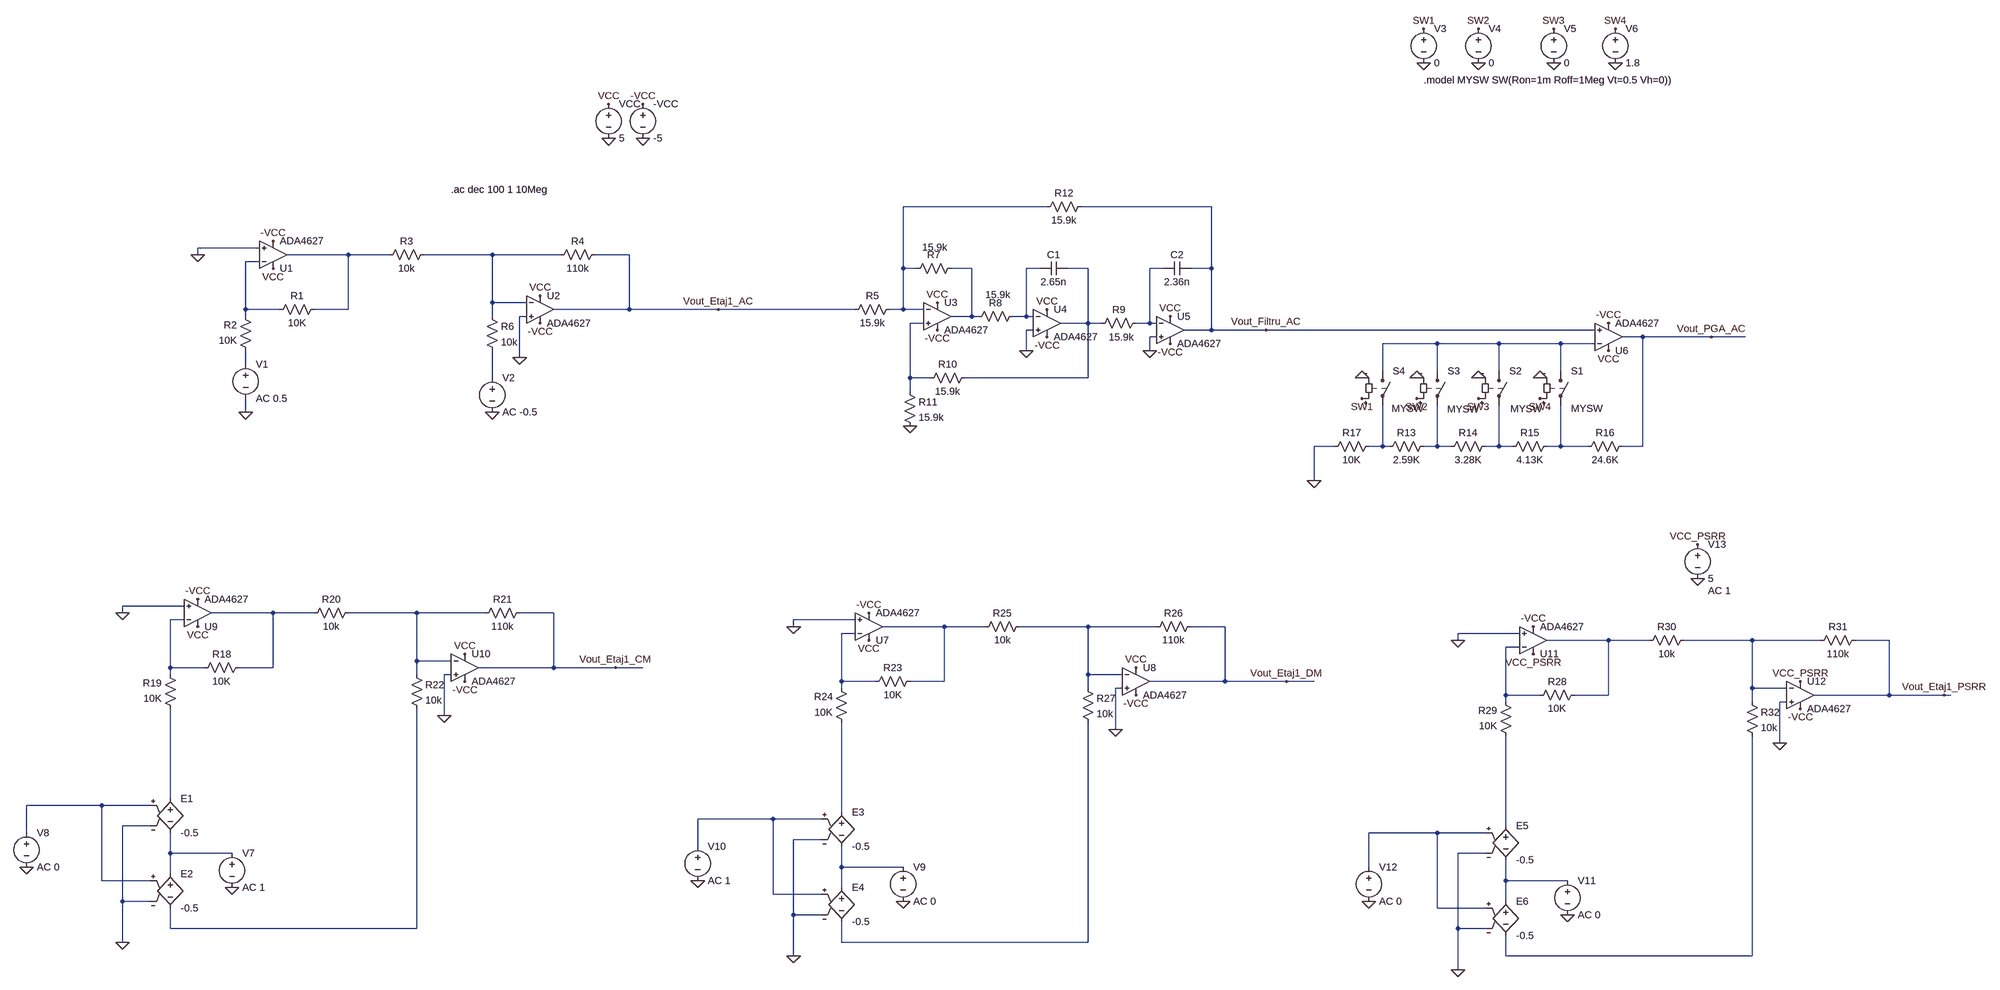
[diagram p0: schematic AnalizaAC.asc]
AnalizaAC.asc, the LTspice schematic file:
Version 4
SHEET 1 4884 2424
WIRE 1904 48 1568 48
WIRE 2288 48 1984 48
WIRE 64 144 -80 144
WIRE -80 160 -80 144
WIRE 272 160 128 160
WIRE 368 160 272 160
WIRE 608 160 448 160
WIRE 768 160 608 160
WIRE 928 160 848 160
WIRE 64 176 32 176
WIRE 1568 192 1568 48
WIRE 1600 192 1568 192
WIRE 1728 192 1680 192
WIRE 1888 192 1856 192
WIRE 2000 192 1952 192
WIRE 2176 192 2144 192
WIRE 2288 192 2288 48
WIRE 2288 192 2240 192
WIRE 608 272 608 160
WIRE 688 272 608 272
WIRE 32 288 32 176
WIRE 112 288 32 288
WIRE 272 288 272 160
WIRE 272 288 192 288
WIRE 928 288 928 160
WIRE 928 288 752 288
WIRE 1136 288 928 288
WIRE 1456 288 1136 288
WIRE 1568 288 1568 192
WIRE 1568 288 1536 288
WIRE 1616 288 1568 288
WIRE 32 304 32 288
WIRE 608 304 608 272
WIRE 688 304 672 304
WIRE 1728 304 1728 192
WIRE 1728 304 1680 304
WIRE 1744 304 1728 304
WIRE 1856 304 1856 192
WIRE 1856 304 1824 304
WIRE 1872 304 1856 304
WIRE 1616 320 1584 320
WIRE 2000 320 2000 192
WIRE 2000 320 1936 320
WIRE 2032 320 2000 320
WIRE 2144 320 2144 192
WIRE 2144 320 2112 320
WIRE 2160 320 2144 320
WIRE 1872 336 1856 336
WIRE 2288 336 2288 192
WIRE 2288 336 2224 336
WIRE 2416 336 2288 336
WIRE 3184 336 2416 336
WIRE 2160 352 2144 352
WIRE 3296 352 3248 352
WIRE 3456 352 3296 352
WIRE 3536 352 3456 352
WIRE 2816 368 2688 368
WIRE 2960 368 2816 368
WIRE 3104 368 2960 368
WIRE 3184 368 3104 368
WIRE 1856 384 1856 336
WIRE 2144 384 2144 352
WIRE 672 400 672 304
WIRE 32 416 32 384
WIRE 2688 432 2688 368
WIRE 2816 432 2816 368
WIRE 2960 432 2960 368
WIRE 3104 432 3104 368
WIRE 608 448 608 384
WIRE 1584 448 1584 320
WIRE 1632 448 1584 448
WIRE 2000 448 2000 320
WIRE 2000 448 1712 448
WIRE 1584 480 1584 448
WIRE 32 528 32 496
WIRE 2576 608 2528 608
WIRE 2688 608 2688 512
WIRE 2688 608 2656 608
WIRE 2704 608 2688 608
WIRE 2816 608 2816 512
WIRE 2816 608 2784 608
WIRE 2848 608 2816 608
WIRE 2960 608 2960 512
WIRE 2960 608 2928 608
WIRE 2992 608 2960 608
WIRE 3104 608 3104 512
WIRE 3104 608 3072 608
WIRE 3168 608 3104 608
WIRE 3296 608 3296 352
WIRE 3296 608 3248 608
WIRE 2528 688 2528 608
WIRE -112 1296 -256 1296
WIRE -256 1312 -256 1296
WIRE 96 1312 -48 1312
WIRE 192 1312 96 1312
WIRE 432 1312 272 1312
WIRE 592 1312 432 1312
WIRE 752 1312 672 1312
WIRE -112 1328 -144 1328
WIRE 1456 1328 1312 1328
WIRE 1312 1344 1312 1328
WIRE 1664 1344 1520 1344
WIRE 1760 1344 1664 1344
WIRE 2000 1344 1840 1344
WIRE 2160 1344 2000 1344
WIRE 2320 1344 2240 1344
WIRE 1456 1360 1424 1360
WIRE 3008 1360 2864 1360
WIRE 2864 1376 2864 1360
WIRE 3216 1376 3072 1376
WIRE 3312 1376 3216 1376
WIRE 3552 1376 3392 1376
WIRE 3712 1376 3552 1376
WIRE 3872 1376 3792 1376
WIRE 3008 1392 2976 1392
WIRE 432 1424 432 1312
WIRE 512 1424 432 1424
WIRE -144 1440 -144 1328
WIRE -64 1440 -144 1440
WIRE 96 1440 96 1312
WIRE 96 1440 16 1440
WIRE 752 1440 752 1312
WIRE 752 1440 576 1440
WIRE 896 1440 752 1440
WIRE 960 1440 896 1440
WIRE -144 1456 -144 1440
WIRE 432 1456 432 1424
WIRE 512 1456 496 1456
WIRE 2000 1456 2000 1344
WIRE 2080 1456 2000 1456
WIRE 1424 1472 1424 1360
WIRE 1504 1472 1424 1472
WIRE 1664 1472 1664 1344
WIRE 1664 1472 1584 1472
WIRE 2320 1472 2320 1344
WIRE 2320 1472 2144 1472
WIRE 2464 1472 2320 1472
WIRE 2528 1472 2464 1472
WIRE 1424 1488 1424 1472
WIRE 2000 1488 2000 1456
WIRE 2080 1488 2064 1488
WIRE 3552 1488 3552 1376
WIRE 3632 1488 3552 1488
WIRE 2976 1504 2976 1392
WIRE 3056 1504 2976 1504
WIRE 3216 1504 3216 1376
WIRE 3216 1504 3136 1504
WIRE 3872 1504 3872 1376
WIRE 3872 1504 3696 1504
WIRE 4000 1504 3872 1504
WIRE 4016 1504 4000 1504
WIRE 2976 1520 2976 1504
WIRE 3552 1520 3552 1488
WIRE 3632 1520 3616 1520
WIRE 496 1552 496 1456
WIRE 2064 1584 2064 1488
WIRE 3616 1616 3616 1520
WIRE -144 1904 -144 1536
WIRE -304 1920 -480 1920
WIRE -192 1920 -304 1920
WIRE 1424 1936 1424 1568
WIRE 1264 1952 1088 1952
WIRE 1376 1952 1264 1952
WIRE -192 1968 -256 1968
WIRE 2976 1968 2976 1600
WIRE -480 1984 -480 1920
WIRE 2816 1984 2656 1984
WIRE 2928 1984 2816 1984
WIRE 1376 2000 1312 2000
WIRE 1088 2016 1088 1952
WIRE -144 2032 -144 1984
WIRE 0 2032 -144 2032
WIRE 2928 2032 2864 2032
WIRE 1424 2064 1424 2016
WIRE 1568 2064 1424 2064
WIRE 2656 2064 2656 1984
WIRE -144 2080 -144 2032
WIRE -304 2096 -304 1920
WIRE -192 2096 -304 2096
WIRE 2976 2096 2976 2048
WIRE 3120 2096 2976 2096
WIRE 1424 2112 1424 2064
WIRE 1264 2128 1264 1952
WIRE 1376 2128 1264 2128
WIRE -256 2144 -256 1968
WIRE -192 2144 -256 2144
WIRE 2976 2144 2976 2096
WIRE 2816 2160 2816 1984
WIRE 2928 2160 2816 2160
WIRE 1312 2176 1312 2000
WIRE 1376 2176 1312 2176
WIRE -144 2208 -144 2160
WIRE 432 2208 432 1536
WIRE 432 2208 -144 2208
WIRE 2864 2208 2864 2032
WIRE 2928 2208 2864 2208
WIRE -256 2240 -256 2144
WIRE 1424 2240 1424 2192
WIRE 2000 2240 2000 1568
WIRE 2000 2240 1424 2240
WIRE 1312 2272 1312 2176
WIRE 2976 2272 2976 2224
WIRE 3552 2272 3552 1600
WIRE 3552 2272 2976 2272
WIRE 2864 2304 2864 2208
FLAG -80 160 0
FLAG 880 -112 0
FLAG 960 -112 0
FLAG 880 -192 VCC
FLAG 960 -192 -VCC
FLAG 96 128 -VCC
FLAG 96 192 VCC
FLAG 32 528 0
FLAG 720 256 VCC
FLAG 720 320 -VCC
FLAG 608 528 0
FLAG 1136 288 Vout_Etaj1_AC
FLAG 672 400 0
FLAG 2144 384 0
FLAG 1856 384 0
FLAG 1584 560 0
FLAG 2416 336 Vout_Filtru_AC
FLAG 1648 272 VCC
FLAG 1904 288 VCC
FLAG 2192 304 VCC
FLAG 2192 368 -VCC
FLAG 1904 352 -VCC
FLAG 1648 336 -VCC
FLAG 2784 -368 SW1
FLAG 2912 -368 SW2
FLAG 3088 -368 SW3
FLAG 3232 -368 SW4
FLAG 2784 -288 0
FLAG 2912 -288 0
FLAG 3088 -288 0
FLAG 3232 -288 0
FLAG 2912 496 SW3
FLAG 3056 496 SW4
FLAG 2768 496 SW2
FLAG 2640 496 SW1
FLAG 2528 688 0
FLAG 3216 320 -VCC
FLAG 3216 384 VCC
FLAG 3456 352 Vout_PGA_AC
FLAG -256 1312 0
FLAG -80 1280 -VCC
FLAG -80 1344 VCC
FLAG 544 1408 VCC
FLAG 544 1472 -VCC
FLAG 496 1552 0
FLAG 0 2112 0
FLAG 896 1440 Vout_Etaj1_CM
FLAG -256 2240 0
FLAG -480 2064 0
FLAG 1312 1344 0
FLAG 1488 1312 -VCC
FLAG 1488 1376 VCC
FLAG 2112 1440 VCC
FLAG 2112 1504 -VCC
FLAG 2064 1584 0
FLAG 1568 2144 0
FLAG 2464 1472 Vout_Etaj1_DM
FLAG 1312 2272 0
FLAG 1088 2096 0
FLAG 2864 1376 0
FLAG 3040 1344 -VCC
FLAG 3664 1536 -VCC
FLAG 3616 1616 0
FLAG 3120 2176 0
FLAG 2864 2304 0
FLAG 2656 2144 0
FLAG 3424 1232 0
FLAG 3424 1152 VCC_PSRR
FLAG 3664 1472 VCC_PSRR
FLAG 4000 1504 Vout_Etaj1_PSRR
FLAG 3040 1408 VCC_PSRR
FLAG 2640 448 0
FLAG 2768 448 0
FLAG 2912 448 0
FLAG 3056 448 0
SYMBOL voltage 880 -208 R0
SYMATTR InstName VCC
SYMATTR Value 5
SYMBOL voltage 960 -208 R0
SYMATTR InstName -VCC
SYMATTR Value -5
SYMBOL OpAmps\\ADA4627 96 224 M180
SYMATTR InstName U1
SYMBOL res 208 272 R90
WINDOW 0 0 56 VBottom 2
WINDOW 3 32 56 VTop 2
SYMATTR InstName R1
SYMATTR Value 10K
SYMBOL res 48 400 R180
WINDOW 0 36 76 Left 2
WINDOW 3 36 40 Left 2
SYMATTR InstName R2
SYMATTR Value 10K
SYMBOL voltage 32 400 R0
SYMATTR InstName V1
SYMATTR Value AC 0.5
SYMBOL res 464 144 R90
WINDOW 0 0 56 VBottom 2
WINDOW 3 32 56 VTop 2
SYMATTR InstName R3
SYMATTR Value 10k
SYMBOL res 864 144 R90
WINDOW 0 0 56 VBottom 2
WINDOW 3 32 56 VTop 2
SYMATTR InstName R4
SYMATTR Value 110k
SYMBOL voltage 608 432 R0
SYMATTR InstName V2
SYMATTR Value AC -0.5
SYMBOL res 592 288 R0
SYMATTR InstName R6
SYMATTR Value 10k
SYMBOL OpAmps\\ADA4627 720 224 R0
SYMATTR InstName U2
SYMBOL OpAmps\\ADA4627 1648 240 R0
SYMATTR InstName U3
SYMBOL OpAmps\\ADA4627 1904 256 R0
SYMATTR InstName U4
SYMBOL OpAmps\\ADA4627 2192 272 R0
SYMATTR InstName U5
SYMBOL res 1552 272 R90
WINDOW 0 0 56 VBottom 2
WINDOW 3 32 56 VTop 2
SYMATTR InstName R5
SYMATTR Value 15.9k
SYMBOL res 1696 176 R90
WINDOW 0 0 56 VBottom 2
WINDOW 3 -49 54 VTop 2
SYMATTR InstName R7
SYMATTR Value 15.9k
SYMBOL res 1840 288 R90
WINDOW 0 0 56 VBottom 2
WINDOW 3 -50 50 VTop 2
SYMATTR InstName R8
SYMATTR Value 15.9k
SYMBOL cap 1952 176 R90
WINDOW 0 0 32 VBottom 2
WINDOW 3 32 32 VTop 2
SYMATTR InstName C1
SYMATTR Value 2.65n
SYMBOL res 2128 304 R90
WINDOW 0 0 56 VBottom 2
WINDOW 3 33 50 VTop 2
SYMATTR InstName R9
SYMATTR Value 15.9k
SYMBOL cap 2176 208 R270
WINDOW 0 32 32 VTop 2
WINDOW 3 0 32 VBottom 2
SYMATTR InstName C2
SYMATTR Value 2.36n
SYMBOL res 1728 432 R90
WINDOW 0 0 56 VBottom 2
WINDOW 3 32 56 VTop 2
SYMATTR InstName R10
SYMATTR Value 15.9k
SYMBOL res 1568 464 R0
SYMATTR InstName R11
SYMATTR Value 15.9k
SYMBOL res 2000 32 R90
WINDOW 0 0 56 VBottom 2
WINDOW 3 32 56 VTop 2
SYMATTR InstName R12
SYMATTR Value 15.9k
SYMBOL voltage 2784 -384 R0
SYMATTR InstName V3
SYMATTR Value 0
SYMBOL voltage 2912 -384 R0
SYMATTR InstName V4
SYMATTR Value 0
SYMBOL voltage 3088 -384 R0
SYMATTR InstName V5
SYMATTR Value 0
SYMBOL voltage 3232 -384 R0
SYMATTR InstName V6
SYMATTR Value 1.8
SYMBOL OpAmps\\ADA4627 3216 416 M180
SYMATTR InstName U6
SYMBOL res 2800 592 R90
WINDOW 0 0 56 VBottom 2
WINDOW 3 32 56 VTop 2
SYMATTR InstName R13
SYMATTR Value 2.59K
SYMBOL res 2944 592 R90
WINDOW 0 0 56 VBottom 2
WINDOW 3 32 56 VTop 2
SYMATTR InstName R14
SYMATTR Value 3.28K
SYMBOL res 3088 592 R90
WINDOW 0 0 56 VBottom 2
WINDOW 3 32 56 VTop 2
SYMATTR InstName R15
SYMATTR Value 4.13K
SYMBOL res 3264 592 R90
WINDOW 0 0 56 VBottom 2
WINDOW 3 32 56 VTop 2
SYMATTR InstName R16
SYMATTR Value 24.6K
SYMBOL res 2672 592 R90
WINDOW 0 0 56 VBottom 2
WINDOW 3 32 56 VTop 2
SYMATTR InstName R17
SYMATTR Value 10K
SYMBOL OpAmps\\ADA4627 -80 1376 M180
SYMATTR InstName U9
SYMBOL res 32 1424 R90
WINDOW 0 0 56 VBottom 2
WINDOW 3 32 56 VTop 2
SYMATTR InstName R18
SYMATTR Value 10K
SYMBOL res -128 1552 R180
WINDOW 0 36 76 Left 2
WINDOW 3 36 40 Left 2
SYMATTR InstName R19
SYMATTR Value 10K
SYMBOL res 288 1296 R90
WINDOW 0 0 56 VBottom 2
WINDOW 3 32 56 VTop 2
SYMATTR InstName R20
SYMATTR Value 10k
SYMBOL res 688 1296 R90
WINDOW 0 0 56 VBottom 2
WINDOW 3 32 56 VTop 2
SYMATTR InstName R21
SYMATTR Value 110k
SYMBOL res 416 1440 R0
SYMATTR InstName R22
SYMATTR Value 10k
SYMBOL OpAmps\\ADA4627 544 1376 R0
SYMATTR InstName U10
SYMBOL e -144 1888 R0
SYMATTR InstName E1
SYMATTR Value -0.5
SYMBOL e -144 2064 R0
SYMATTR InstName E2
SYMATTR Value -0.5
SYMBOL voltage 0 2016 R0
SYMATTR InstName V7
SYMATTR Value AC 1
SYMBOL voltage -480 1968 R0
SYMATTR InstName V8
SYMATTR Value AC 0
SYMBOL OpAmps\\ADA4627 1488 1408 M180
SYMATTR InstName U7
SYMBOL res 1600 1456 R90
WINDOW 0 0 56 VBottom 2
WINDOW 3 32 56 VTop 2
SYMATTR InstName R23
SYMATTR Value 10K
SYMBOL res 1440 1584 R180
WINDOW 0 36 76 Left 2
WINDOW 3 36 40 Left 2
SYMATTR InstName R24
SYMATTR Value 10K
SYMBOL res 1856 1328 R90
WINDOW 0 0 56 VBottom 2
WINDOW 3 32 56 VTop 2
SYMATTR InstName R25
SYMATTR Value 10k
SYMBOL res 2256 1328 R90
WINDOW 0 0 56 VBottom 2
WINDOW 3 32 56 VTop 2
SYMATTR InstName R26
SYMATTR Value 110k
SYMBOL res 1984 1472 R0
SYMATTR InstName R27
SYMATTR Value 10k
SYMBOL OpAmps\\ADA4627 2112 1408 R0
SYMATTR InstName U8
SYMBOL e 1424 1920 R0
SYMATTR InstName E3
SYMATTR Value -0.5
SYMBOL e 1424 2096 R0
SYMATTR InstName E4
SYMATTR Value -0.5
SYMBOL voltage 1568 2048 R0
SYMATTR InstName V9
SYMATTR Value AC 0
SYMBOL voltage 1088 2000 R0
SYMATTR InstName V10
SYMATTR Value AC 1
SYMBOL OpAmps\\ADA4627 3040 1440 M180
SYMATTR InstName U11
SYMBOL res 3152 1488 R90
WINDOW 0 0 56 VBottom 2
WINDOW 3 32 56 VTop 2
SYMATTR InstName R28
SYMATTR Value 10K
SYMBOL res 2992 1616 R180
WINDOW 0 36 76 Left 2
WINDOW 3 36 40 Left 2
SYMATTR InstName R29
SYMATTR Value 10K
SYMBOL res 3408 1360 R90
WINDOW 0 0 56 VBottom 2
WINDOW 3 32 56 VTop 2
SYMATTR InstName R30
SYMATTR Value 10k
SYMBOL res 3808 1360 R90
WINDOW 0 0 56 VBottom 2
WINDOW 3 32 56 VTop 2
SYMATTR InstName R31
SYMATTR Value 110k
SYMBOL res 3536 1504 R0
SYMATTR InstName R32
SYMATTR Value 10k
SYMBOL OpAmps\\ADA4627 3664 1440 R0
SYMATTR InstName U12
SYMBOL e 2976 1952 R0
SYMATTR InstName E5
SYMATTR Value -0.5
SYMBOL e 2976 2128 R0
SYMATTR InstName E6
SYMATTR Value -0.5
SYMBOL voltage 3120 2080 R0
SYMATTR InstName V11
SYMATTR Value AC 0
SYMBOL voltage 2656 2048 R0
SYMATTR InstName V12
SYMATTR Value AC 0
SYMBOL voltage 3424 1136 R0
WINDOW 123 24 124 Left 2
WINDOW 39 0 0 Left 0
SYMATTR Value2 AC 1
SYMATTR InstName V13
SYMATTR Value 5
SYMBOL sw 3104 416 R0
WINDOW 3 24 103 Left 2
SYMATTR Value MYSW
SYMATTR InstName S1
SYMBOL sw 2960 416 R0
WINDOW 3 27 104 Left 2
SYMATTR Value MYSW
SYMATTR InstName S2
SYMBOL sw 2816 416 R0
WINDOW 3 23 105 Left 2
SYMATTR Value MYSW
SYMATTR InstName S3
SYMBOL sw 2688 416 R0
WINDOW 3 21 103 Left 2
SYMATTR Value MYSW
SYMATTR InstName S4
TEXT 512 8 Left 2 !.ac dec 100 1 10Meg
TEXT 2784 -248 Left 2 !.model MYSW SW(Ron=1m Roff=1Meg Vt=0.5 Vh=0))

The netlist it stands for:
* AnalizaAC.asc
VCC VCC 0 5
V§-VCC -VCC 0 -5
XU1 0 N004 VCC -VCC N002 ADA4627  ; pins In+ In- V+ V- OUT
R1 N002 N004 10K
R2 N011 N004 10K
V1 N011 0 AC 0.5
R3 N003 N002 10k
R4 Vout_Etaj1_AC N003 110k
V2 N012 0 AC -0.5
R6 N003 N012 10k
XU2 0 N003 VCC -VCC Vout_Etaj1_AC ADA4627  ; pins In+ In- V+ V- OUT
XU3 N009 N001 VCC -VCC N005 ADA4627  ; pins In+ In- V+ V- OUT
XU4 0 N006 VCC -VCC N007 ADA4627  ; pins In+ In- V+ V- OUT
XU5 0 N008 VCC -VCC Vout_Filtru_AC ADA4627  ; pins In+ In- V+ V- OUT
R5 N001 Vout_Etaj1_AC 15.9k
R7 N005 N001 15.9k
R8 N006 N005 15.9k
C1 N007 N006 2.65n
R9 N008 N007 15.9k
C2 N008 Vout_Filtru_AC 2.36n
R10 N007 N009 15.9k
R11 N009 0 15.9k
R12 Vout_Filtru_AC N001 15.9k
V3 SW1 0 0
V4 SW2 0 0
V5 SW3 0 0
V6 SW4 0 1.8
XU6 Vout_Filtru_AC N010 VCC -VCC Vout_PGA_AC ADA4627  ; pins In+ In- V+ V- OUT
R13 N014 N013 2.59K
R14 N015 N014 3.28K
R15 N016 N015 4.13K
R16 Vout_PGA_AC N016 24.6K
R17 N013 0 10K
XU9 0 N019 VCC -VCC N017 ADA4627  ; pins In+ In- V+ V- OUT
R18 N017 N019 10K
R19 N026 N019 10K
R20 N018 N017 10k
R21 Vout_Etaj1_CM N018 110k
R22 N018 N035 10k
XU10 0 N018 VCC -VCC Vout_Etaj1_CM ADA4627  ; pins In+ In- V+ V- OUT
E1 N026 N032 N027 0 -0.5
E2 N032 N035 N027 0 -0.5
V7 N032 0 AC 1
V8 N027 0 AC 0
XU7 0 N022 VCC -VCC N020 ADA4627  ; pins In+ In- V+ V- OUT
R23 N020 N022 10K
R24 N028 N022 10K
R25 N021 N020 10k
R26 Vout_Etaj1_DM N021 110k
R27 N021 N036 10k
XU8 0 N021 VCC -VCC Vout_Etaj1_DM ADA4627  ; pins In+ In- V+ V- OUT
E3 N028 N033 N029 0 -0.5
E4 N033 N036 N029 0 -0.5
V9 N033 0 AC 0
V10 N029 0 AC 1
XU11 0 N025 VCC_PSRR -VCC N023 ADA4627  ; pins In+ In- V+ V- OUT
R28 N023 N025 10K
R29 N030 N025 10K
R30 N024 N023 10k
R31 Vout_Etaj1_PSRR N024 110k
R32 N024 N037 10k
XU12 0 N024 VCC_PSRR -VCC Vout_Etaj1_PSRR ADA4627  ; pins In+ In- V+ V- OUT
E5 N030 N034 N031 0 -0.5
E6 N034 N037 N031 0 -0.5
V11 N034 0 AC 0
V12 N031 0 AC 0
V13 VCC_PSRR 0 5 AC 1
S1 N010 N016 SW4 0 MYSW
S2 N010 N015 SW3 0 MYSW
S3 N010 N014 SW2 0 MYSW
S4 N010 N013 SW1 0 MYSW
.ac dec 100 1 10Meg
.model MYSW SW(Ron=1m Roff=1Meg Vt=0.5 Vh=0))
.backanno
.end